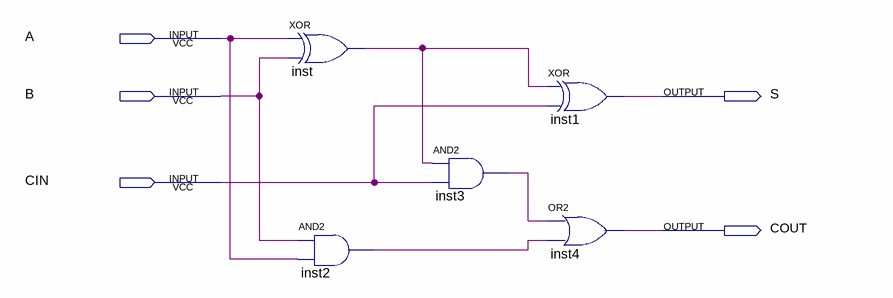
[diagram p0: schematic sheet]
// Quartus schematic FULLADDER.bdf as structural Verilog: 5 symbols, 5 pins
module FULLADDER (
  input  A,
  input  B,
  input  CIN,
  output S,
  output COUT
);

  wire inst2_out, inst3_out, inst_out;

  xor inst (inst_out, A, B);
  and inst2 (inst2_out, B, A);
  and inst3 (inst3_out, inst_out, CIN);
  xor inst1 (S, inst_out, CIN);
  or inst4 (COUT, inst3_out, inst2_out);
endmodule
